# Vivado block design rfdc_ex, xczu48dr-fsvg1517-2-e, Vivado 2021.2
# (continued, part 2 of 4)
current_bd_instance /clocking_block

# ---- hierarchy /PS_Subsystem ----
current_bd_instance /PS_Subsystem
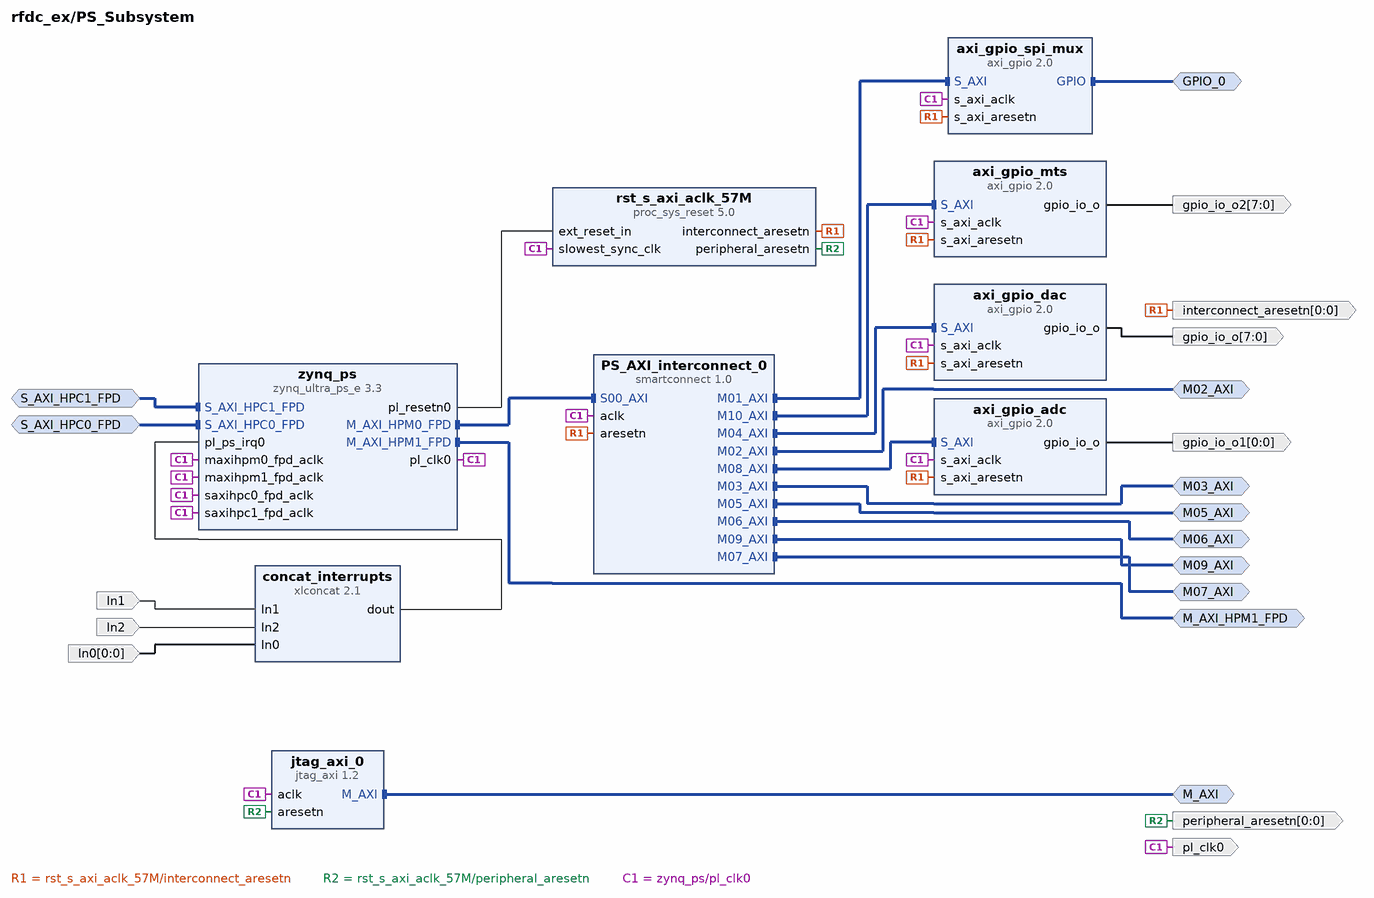
[diagram p4: block diagram inside /PS_Subsystem]
create_bd_intf_pin -mode Master -vlnv xilinx.com:interface:aximm_rtl:1.0 M_AXI
create_bd_intf_pin -mode Master -vlnv xilinx.com:interface:aximm_rtl:1.0 M_AXI_HPM1_FPD
create_bd_intf_pin -mode Master -vlnv xilinx.com:interface:gpio_rtl:1.0 GPIO_0
create_bd_intf_pin -mode Slave -vlnv xilinx.com:interface:aximm_rtl:1.0 S_AXI_HPC1_FPD
create_bd_intf_pin -mode Master -vlnv xilinx.com:interface:aximm_rtl:1.0 M02_AXI
create_bd_intf_pin -mode Master -vlnv xilinx.com:interface:aximm_rtl:1.0 M03_AXI
create_bd_intf_pin -mode Master -vlnv xilinx.com:interface:aximm_rtl:1.0 M05_AXI
create_bd_intf_pin -mode Master -vlnv xilinx.com:interface:aximm_rtl:1.0 M06_AXI
create_bd_intf_pin -mode Master -vlnv xilinx.com:interface:aximm_rtl:1.0 M07_AXI
create_bd_intf_pin -mode Master -vlnv xilinx.com:interface:aximm_rtl:1.0 M09_AXI
create_bd_intf_pin -mode Slave -vlnv xilinx.com:interface:aximm_rtl:1.0 S_AXI_HPC0_FPD
create_bd_pin -dir I -from 0 -to 0 In0
create_bd_pin -dir O -type clk pl_clk0
create_bd_pin -dir O -from 0 -to 0 -type rst peripheral_aresetn
create_bd_pin -dir O -from 0 -to 0 -type rst interconnect_aresetn
create_bd_pin -dir O -from 7 -to 0 gpio_io_o
create_bd_pin -dir I -type intr In1
create_bd_pin -dir O -from 0 -to 0 gpio_io_o1
create_bd_pin -dir I -type intr In2
create_bd_pin -dir O -from 7 -to 0 gpio_io_o2

create_bd_cell -type ip -vlnv xilinx.com:ip:xlconcat:2.1 concat_interrupts
set_property -dict {CONFIG.NUM_PORTS 3} [get_bd_cells concat_interrupts]
create_bd_cell -type ip -vlnv xilinx.com:ip:jtag_axi:1.2 jtag_axi_0
create_bd_cell -type ip -vlnv xilinx.com:ip:zynq_ultra_ps_e:3.3 zynq_ps
set_property -dict [list \
  CONFIG.PSU_BANK_0_IO_STANDARD LVCMOS18 \
  CONFIG.PSU_BANK_1_IO_STANDARD LVCMOS18 \
  CONFIG.PSU_BANK_2_IO_STANDARD LVCMOS18 \
  CONFIG.PSU_USB3__DUAL_CLOCK_ENABLE 1 \
  CONFIG.PSU__CAN1__PERIPHERAL__ENABLE 0 \
  CONFIG.PSU__CRF_APB__ACPU_CTRL__FREQMHZ 1200 \
  CONFIG.PSU__CRF_APB__ACPU_CTRL__SRCSEL APLL \
  CONFIG.PSU__CRF_APB__APLL_CTRL__SRCSEL PSS_REF_CLK \
  CONFIG.PSU__CRF_APB__DBG_FPD_CTRL__FREQMHZ 250 \
  CONFIG.PSU__CRF_APB__DBG_FPD_CTRL__SRCSEL IOPLL \
  CONFIG.PSU__CRF_APB__DBG_TRACE_CTRL__FREQMHZ 250 \
  CONFIG.PSU__CRF_APB__DBG_TRACE_CTRL__SRCSEL IOPLL \
  CONFIG.PSU__CRF_APB__DBG_TSTMP_CTRL__FREQMHZ 250 \
  CONFIG.PSU__CRF_APB__DBG_TSTMP_CTRL__SRCSEL IOPLL \
  CONFIG.PSU__CRF_APB__DDR_CTRL__FREQMHZ 1066 \
  CONFIG.PSU__CRF_APB__DDR_CTRL__SRCSEL DPLL \
  CONFIG.PSU__CRF_APB__DPDMA_REF_CTRL__FREQMHZ 600 \
  CONFIG.PSU__CRF_APB__DPDMA_REF_CTRL__SRCSEL APLL \
  CONFIG.PSU__CRF_APB__DPLL_CTRL__SRCSEL PSS_REF_CLK \
  CONFIG.PSU__CRF_APB__DP_AUDIO_REF_CTRL__SRCSEL RPLL \
  CONFIG.PSU__CRF_APB__DP_STC_REF_CTRL__SRCSEL RPLL \
  CONFIG.PSU__CRF_APB__DP_VIDEO_REF_CTRL__SRCSEL VPLL \
  CONFIG.PSU__CRF_APB__GDMA_REF_CTRL__FREQMHZ 600 \
  CONFIG.PSU__CRF_APB__GDMA_REF_CTRL__SRCSEL APLL \
  CONFIG.PSU__CRF_APB__GPU_REF_CTRL__FREQMHZ 500 \
  CONFIG.PSU__CRF_APB__GPU_REF_CTRL__SRCSEL IOPLL \
  CONFIG.PSU__CRF_APB__TOPSW_LSBUS_CTRL__FREQMHZ 100 \
  CONFIG.PSU__CRF_APB__TOPSW_LSBUS_CTRL__SRCSEL IOPLL \
  CONFIG.PSU__CRF_APB__TOPSW_MAIN_CTRL__FREQMHZ 533.33 \
  CONFIG.PSU__CRF_APB__TOPSW_MAIN_CTRL__SRCSEL DPLL \
  CONFIG.PSU__CRF_APB__VPLL_CTRL__SRCSEL PSS_REF_CLK \
  CONFIG.PSU__CRL_APB__ADMA_REF_CTRL__FREQMHZ 500 \
  CONFIG.PSU__CRL_APB__ADMA_REF_CTRL__SRCSEL IOPLL \
  CONFIG.PSU__CRL_APB__CAN1_REF_CTRL__FREQMHZ 100 \
  CONFIG.PSU__CRL_APB__CAN1_REF_CTRL__SRCSEL IOPLL \
  CONFIG.PSU__CRL_APB__CPU_R5_CTRL__FREQMHZ 500 \
  CONFIG.PSU__CRL_APB__CPU_R5_CTRL__SRCSEL IOPLL \
  CONFIG.PSU__CRL_APB__DBG_LPD_CTRL__FREQMHZ 250 \
  CONFIG.PSU__CRL_APB__DBG_LPD_CTRL__SRCSEL IOPLL \
  CONFIG.PSU__CRL_APB__GEM3_REF_CTRL__FREQMHZ 125 \
  CONFIG.PSU__CRL_APB__GEM3_REF_CTRL__SRCSEL IOPLL \
  CONFIG.PSU__CRL_APB__I2C0_REF_CTRL__FREQMHZ 100 \
  CONFIG.PSU__CRL_APB__I2C0_REF_CTRL__SRCSEL IOPLL \
  CONFIG.PSU__CRL_APB__I2C1_REF_CTRL__FREQMHZ 100 \
  CONFIG.PSU__CRL_APB__I2C1_REF_CTRL__SRCSEL IOPLL \
  CONFIG.PSU__CRL_APB__IOPLL_CTRL__SRCSEL PSS_REF_CLK \
  CONFIG.PSU__CRL_APB__IOU_SWITCH_CTRL__FREQMHZ 250 \
  CONFIG.PSU__CRL_APB__IOU_SWITCH_CTRL__SRCSEL IOPLL \
  CONFIG.PSU__CRL_APB__LPD_LSBUS_CTRL__FREQMHZ 100 \
  CONFIG.PSU__CRL_APB__LPD_LSBUS_CTRL__SRCSEL IOPLL \
  CONFIG.PSU__CRL_APB__LPD_SWITCH_CTRL__FREQMHZ 500 \
  CONFIG.PSU__CRL_APB__LPD_SWITCH_CTRL__SRCSEL IOPLL \
  CONFIG.PSU__CRL_APB__PCAP_CTRL__FREQMHZ 200 \
  CONFIG.PSU__CRL_APB__PCAP_CTRL__SRCSEL IOPLL \
  CONFIG.PSU__CRL_APB__PL0_REF_CTRL__FREQMHZ 100 \
  CONFIG.PSU__CRL_APB__PL0_REF_CTRL__SRCSEL IOPLL \
  CONFIG.PSU__CRL_APB__QSPI_REF_CTRL__FREQMHZ 125 \
  CONFIG.PSU__CRL_APB__QSPI_REF_CTRL__SRCSEL IOPLL \
  CONFIG.PSU__CRL_APB__RPLL_CTRL__SRCSEL PSS_REF_CLK \
  CONFIG.PSU__CRL_APB__SDIO1_REF_CTRL__FREQMHZ 200 \
  CONFIG.PSU__CRL_APB__SDIO1_REF_CTRL__SRCSEL IOPLL \
  CONFIG.PSU__CRL_APB__TIMESTAMP_REF_CTRL__FREQMHZ 100 \
  CONFIG.PSU__CRL_APB__TIMESTAMP_REF_CTRL__SRCSEL IOPLL \
  CONFIG.PSU__CRL_APB__UART0_REF_CTRL__FREQMHZ 100 \
  CONFIG.PSU__CRL_APB__UART0_REF_CTRL__SRCSEL IOPLL \
  CONFIG.PSU__CRL_APB__UART1_REF_CTRL__FREQMHZ 100 \
  CONFIG.PSU__CRL_APB__UART1_REF_CTRL__SRCSEL IOPLL \
  CONFIG.PSU__CRL_APB__USB0_BUS_REF_CTRL__FREQMHZ 250 \
  CONFIG.PSU__CRL_APB__USB0_BUS_REF_CTRL__SRCSEL IOPLL \
  CONFIG.PSU__CRL_APB__USB3_DUAL_REF_CTRL__FREQMHZ 20 \
  CONFIG.PSU__CRL_APB__USB3_DUAL_REF_CTRL__SRCSEL IOPLL \
  CONFIG.PSU__CRL_APB__USB3__ENABLE 1 \
  CONFIG.PSU__CSUPMU__PERIPHERAL__VALID 1 \
  CONFIG.PSU__DDRC__BUS_WIDTH {64 Bit} \
  CONFIG.PSU__DDRC__COMPONENTS UDIMM \
  CONFIG.PSU__DDRC__DEVICE_CAPACITY {8192 MBits} \
  CONFIG.PSU__DDRC__DRAM_WIDTH {16 Bits} \
  CONFIG.PSU__DDRC__ECC Disabled \
  CONFIG.PSU__DDRC__MEMORY_TYPE {DDR 4} \
  CONFIG.PSU__DDRC__SPEED_BIN DDR4_2133P \
  CONFIG.PSU__DDR_HIGH_ADDRESS_GUI_ENABLE 1 \
  CONFIG.PSU__DDR__INTERFACE__FREQMHZ 533.000 \
  CONFIG.PSU__DLL__ISUSED 1 \
  CONFIG.PSU__ENET3__FIFO__ENABLE 0 \
  CONFIG.PSU__ENET3__GRP_MDIO__ENABLE 1 \
  CONFIG.PSU__ENET3__GRP_MDIO__IO {MIO 76 .. 77} \
  CONFIG.PSU__ENET3__PERIPHERAL__ENABLE 1 \
  CONFIG.PSU__ENET3__PERIPHERAL__IO {MIO 64 .. 75} \
  CONFIG.PSU__ENET3__PTP__ENABLE 0 \
  CONFIG.PSU__ENET3__TSU__ENABLE 0 \
  CONFIG.PSU__FPGA_PL0_ENABLE 1 \
  CONFIG.PSU__GEM3_COHERENCY 0 \
  CONFIG.PSU__GEM3_ROUTE_THROUGH_FPD 0 \
  CONFIG.PSU__GEM__TSU__ENABLE 0 \
  CONFIG.PSU__GPIO0_MIO__IO {MIO 0 .. 25} \
  CONFIG.PSU__GPIO0_MIO__PERIPHERAL__ENABLE 1 \
  CONFIG.PSU__GPIO1_MIO__IO {MIO 26 .. 51} \
  CONFIG.PSU__GPIO1_MIO__PERIPHERAL__ENABLE 1 \
  CONFIG.PSU__I2C0__PERIPHERAL__ENABLE 1 \
  CONFIG.PSU__I2C0__PERIPHERAL__IO {MIO 14 .. 15} \
  CONFIG.PSU__I2C1__PERIPHERAL__ENABLE 1 \
  CONFIG.PSU__I2C1__PERIPHERAL__IO {MIO 16 .. 17} \
  CONFIG.PSU__IOU_SLCR__IOU_TTC_APB_CLK__TTC0_SEL APB \
  CONFIG.PSU__IOU_SLCR__IOU_TTC_APB_CLK__TTC1_SEL APB \
  CONFIG.PSU__IOU_SLCR__IOU_TTC_APB_CLK__TTC2_SEL APB \
  CONFIG.PSU__IOU_SLCR__IOU_TTC_APB_CLK__TTC3_SEL APB \
  CONFIG.PSU__MAXIGP0__DATA_WIDTH 128 \
  CONFIG.PSU__OVERRIDE__BASIC_CLOCK 0 \
  CONFIG.PSU__PMU_COHERENCY 0 \
  CONFIG.PSU__PMU__AIBACK__ENABLE 0 \
  CONFIG.PSU__PMU__EMIO_GPI__ENABLE 0 \
  CONFIG.PSU__PMU__EMIO_GPO__ENABLE 0 \
  CONFIG.PSU__PMU__GPI0__ENABLE 0 \
  CONFIG.PSU__PMU__GPI1__ENABLE 0 \
  CONFIG.PSU__PMU__GPI2__ENABLE 0 \
  CONFIG.PSU__PMU__GPI3__ENABLE 0 \
  CONFIG.PSU__PMU__GPI4__ENABLE 0 \
  CONFIG.PSU__PMU__GPI5__ENABLE 0 \
  CONFIG.PSU__PMU__GPO0__ENABLE 1 \
  CONFIG.PSU__PMU__GPO0__IO {MIO 32} \
  CONFIG.PSU__PMU__GPO1__ENABLE 1 \
  CONFIG.PSU__PMU__GPO1__IO {MIO 33} \
  CONFIG.PSU__PMU__GPO2__ENABLE 1 \
  CONFIG.PSU__PMU__GPO2__IO {MIO 34} \
  CONFIG.PSU__PMU__GPO2__POLARITY low \
  CONFIG.PSU__PMU__GPO3__ENABLE 1 \
  CONFIG.PSU__PMU__GPO3__IO {MIO 35} \
  CONFIG.PSU__PMU__GPO3__POLARITY low \
  CONFIG.PSU__PMU__GPO4__ENABLE 1 \
  CONFIG.PSU__PMU__GPO4__IO {MIO 36} \
  CONFIG.PSU__PMU__GPO4__POLARITY low \
  CONFIG.PSU__PMU__GPO5__ENABLE 1 \
  CONFIG.PSU__PMU__GPO5__IO {MIO 37} \
  CONFIG.PSU__PMU__GPO5__POLARITY low \
  CONFIG.PSU__PMU__PERIPHERAL__ENABLE 1 \
  CONFIG.PSU__PMU__PLERROR__ENABLE 0 \
  CONFIG.PSU__PRESET_APPLIED 1 \
  CONFIG.PSU__PSS_REF_CLK__FREQMHZ 33.333 \
  CONFIG.PSU__QSPI_COHERENCY 0 \
  CONFIG.PSU__QSPI_ROUTE_THROUGH_FPD 0 \
  CONFIG.PSU__QSPI__GRP_FBCLK__ENABLE 1 \
  CONFIG.PSU__QSPI__GRP_FBCLK__IO {MIO 6} \
  CONFIG.PSU__QSPI__PERIPHERAL__DATA_MODE x4 \
  CONFIG.PSU__QSPI__PERIPHERAL__ENABLE 1 \
  CONFIG.PSU__QSPI__PERIPHERAL__IO {MIO 0 .. 12} \
  CONFIG.PSU__QSPI__PERIPHERAL__MODE {Dual Parallel} \
  CONFIG.PSU__SATA__LANE1__IO {GT Lane3} \
  CONFIG.PSU__SATA__PERIPHERAL__ENABLE 1 \
  CONFIG.PSU__SATA__REF_CLK_FREQ 125 \
  CONFIG.PSU__SATA__REF_CLK_SEL {Ref Clk3} \
  CONFIG.PSU__SAXIGP0__DATA_WIDTH 32 \
  CONFIG.PSU__SAXIGP1__DATA_WIDTH 32 \
  CONFIG.PSU__SD1_COHERENCY 0 \
  CONFIG.PSU__SD1_ROUTE_THROUGH_FPD 0 \
  CONFIG.PSU__SD1__DATA_TRANSFER_MODE 8Bit \
  CONFIG.PSU__SD1__GRP_CD__ENABLE 1 \
  CONFIG.PSU__SD1__GRP_CD__IO {MIO 45} \
  CONFIG.PSU__SD1__GRP_POW__ENABLE 0 \
  CONFIG.PSU__SD1__GRP_WP__ENABLE 0 \
  CONFIG.PSU__SD1__PERIPHERAL__ENABLE 1 \
  CONFIG.PSU__SD1__PERIPHERAL__IO {MIO 39 .. 51} \
  CONFIG.PSU__SD1__SLOT_TYPE {SD 3.0} \
  CONFIG.PSU__SWDT0__CLOCK__ENABLE 0 \
  CONFIG.PSU__SWDT0__PERIPHERAL__ENABLE 1 \
  CONFIG.PSU__SWDT0__RESET__ENABLE 0 \
  CONFIG.PSU__SWDT1__CLOCK__ENABLE 0 \
  CONFIG.PSU__SWDT1__PERIPHERAL__ENABLE 1 \
  CONFIG.PSU__SWDT1__RESET__ENABLE 0 \
  CONFIG.PSU__TSU__BUFG_PORT_PAIR 0 \
  CONFIG.PSU__TTC0__CLOCK__ENABLE 0 \
  CONFIG.PSU__TTC0__PERIPHERAL__ENABLE 1 \
  CONFIG.PSU__TTC0__WAVEOUT__ENABLE 0 \
  CONFIG.PSU__TTC1__CLOCK__ENABLE 0 \
  CONFIG.PSU__TTC1__PERIPHERAL__ENABLE 1 \
  CONFIG.PSU__TTC1__WAVEOUT__ENABLE 0 \
  CONFIG.PSU__TTC2__CLOCK__ENABLE 0 \
  CONFIG.PSU__TTC2__PERIPHERAL__ENABLE 1 \
  CONFIG.PSU__TTC2__WAVEOUT__ENABLE 0 \
  CONFIG.PSU__TTC3__CLOCK__ENABLE 0 \
  CONFIG.PSU__TTC3__PERIPHERAL__ENABLE 1 \
  CONFIG.PSU__TTC3__WAVEOUT__ENABLE 0 \
  CONFIG.PSU__UART0__BAUD_RATE 115200 \
  CONFIG.PSU__UART0__MODEM__ENABLE 0 \
  CONFIG.PSU__UART0__PERIPHERAL__ENABLE 1 \
  CONFIG.PSU__UART0__PERIPHERAL__IO {MIO 18 .. 19} \
  CONFIG.PSU__USB0_COHERENCY 0 \
  CONFIG.PSU__USB0__PERIPHERAL__ENABLE 1 \
  CONFIG.PSU__USB0__PERIPHERAL__IO {MIO 52 .. 63} \
  CONFIG.PSU__USB0__REF_CLK_FREQ 26 \
  CONFIG.PSU__USB0__REF_CLK_SEL {Ref Clk2} \
  CONFIG.PSU__USB2_0__EMIO__ENABLE 0 \
  CONFIG.PSU__USB3_0__EMIO__ENABLE 0 \
  CONFIG.PSU__USB3_0__PERIPHERAL__ENABLE 1 \
  CONFIG.PSU__USB3_0__PERIPHERAL__IO {GT Lane2} \
  CONFIG.PSU__USB__RESET__MODE {Boot Pin} \
  CONFIG.PSU__USB__RESET__POLARITY {Active Low} \
  CONFIG.PSU__USE__IRQ0 1 \
  CONFIG.PSU__USE__M_AXI_GP0 1 \
  CONFIG.PSU__USE__M_AXI_GP1 1 \
  CONFIG.PSU__USE__M_AXI_GP2 0 \
  CONFIG.PSU__USE__S_AXI_GP0 1 \
  CONFIG.PSU__USE__S_AXI_GP1 1 \
] [get_bd_cells zynq_ps]
# 102 more settings of zynq_ps are not shown: defaults, MIO pin electricals, DDR timing, and values the tool derives
create_bd_cell -type ip -vlnv xilinx.com:ip:smartconnect:1.0 PS_AXI_interconnect_0
set_property -dict [list \
  CONFIG.ADVANCED_PROPERTIES { __view__ { functional { SW0 { DATA_WIDTH 256 } } }} \
  CONFIG.HAS_ARESETN 1 \
  CONFIG.NUM_CLKS 1 \
  CONFIG.NUM_MI 11 \
  CONFIG.NUM_SI 1 \
] [get_bd_cells PS_AXI_interconnect_0]
create_bd_cell -type ip -vlnv xilinx.com:ip:proc_sys_reset:5.0 rst_s_axi_aclk_57M
create_bd_cell -type ip -vlnv xilinx.com:ip:axi_gpio:2.0 axi_gpio_spi_mux
set_property -dict {CONFIG.C_ALL_OUTPUTS 1 CONFIG.C_GPIO_WIDTH 2} [get_bd_cells axi_gpio_spi_mux]
create_bd_cell -type ip -vlnv xilinx.com:ip:axi_gpio:2.0 axi_gpio_dac
set_property -dict {CONFIG.C_ALL_OUTPUTS 1 CONFIG.C_GPIO_WIDTH 8} [get_bd_cells axi_gpio_dac]
create_bd_cell -type ip -vlnv xilinx.com:ip:axi_gpio:2.0 axi_gpio_adc
set_property -dict {CONFIG.C_ALL_OUTPUTS 1 CONFIG.C_DOUT_DEFAULT 0x0000000f CONFIG.C_GPIO_WIDTH 1} [get_bd_cells axi_gpio_adc]
create_bd_cell -type ip -vlnv xilinx.com:ip:axi_gpio:2.0 axi_gpio_mts
set_property -dict {CONFIG.C_ALL_OUTPUTS 1 CONFIG.C_DOUT_DEFAULT 0xffffffff CONFIG.C_GPIO_WIDTH 8} [get_bd_cells axi_gpio_mts]

# ---- hierarchy /DAC_DDR_DMA ----
current_bd_instance /DAC_DDR_DMA
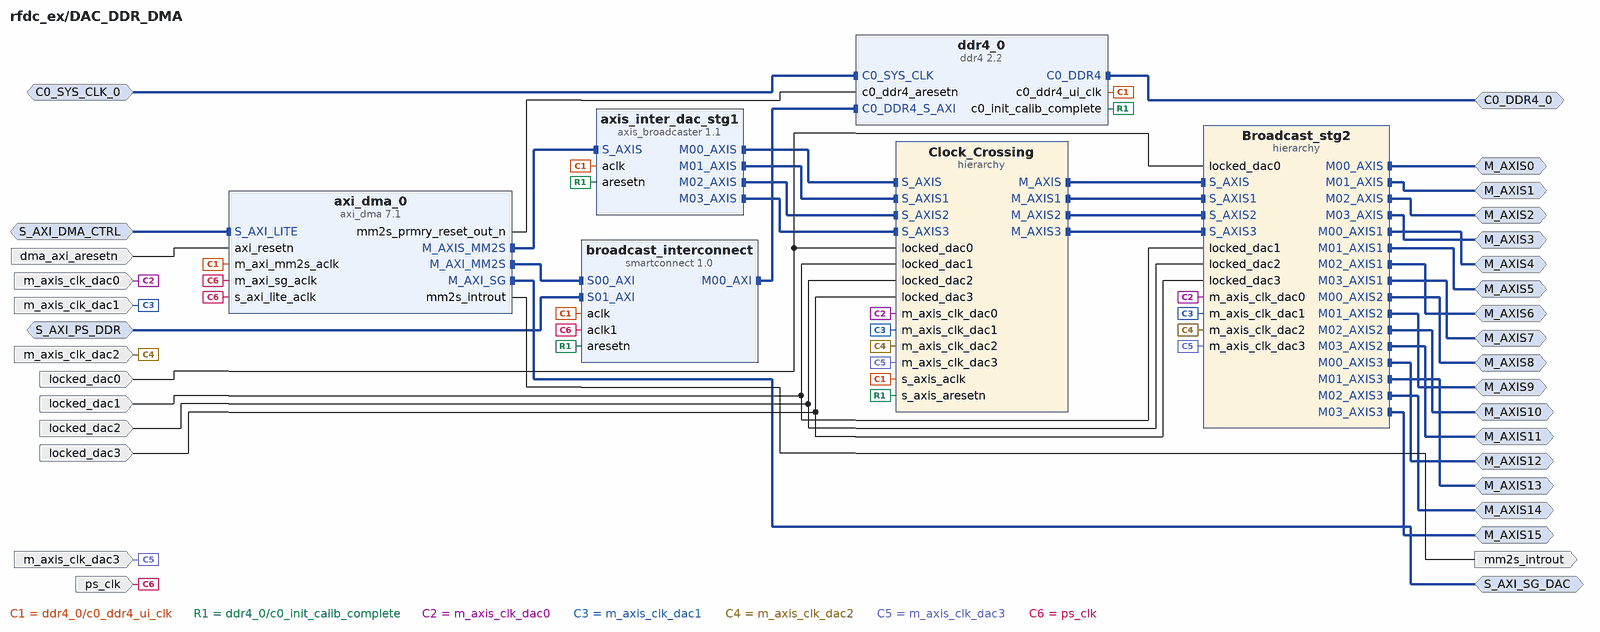
[diagram p5: block diagram inside /DAC_DDR_DMA]
create_bd_intf_pin -mode Master -vlnv xilinx.com:interface:ddr4_rtl:1.0 C0_DDR4_0
create_bd_intf_pin -mode Slave -vlnv xilinx.com:interface:diff_clock_rtl:1.0 C0_SYS_CLK_0
create_bd_intf_pin -mode Master -vlnv xilinx.com:interface:axis_rtl:1.0 M_AXIS0
create_bd_intf_pin -mode Master -vlnv xilinx.com:interface:axis_rtl:1.0 M_AXIS1
create_bd_intf_pin -mode Master -vlnv xilinx.com:interface:axis_rtl:1.0 M_AXIS2
create_bd_intf_pin -mode Master -vlnv xilinx.com:interface:axis_rtl:1.0 M_AXIS3
create_bd_intf_pin -mode Master -vlnv xilinx.com:interface:axis_rtl:1.0 M_AXIS4
create_bd_intf_pin -mode Master -vlnv xilinx.com:interface:axis_rtl:1.0 M_AXIS5
create_bd_intf_pin -mode Master -vlnv xilinx.com:interface:axis_rtl:1.0 M_AXIS6
create_bd_intf_pin -mode Master -vlnv xilinx.com:interface:axis_rtl:1.0 M_AXIS7
create_bd_intf_pin -mode Master -vlnv xilinx.com:interface:axis_rtl:1.0 M_AXIS8
create_bd_intf_pin -mode Master -vlnv xilinx.com:interface:axis_rtl:1.0 M_AXIS9
create_bd_intf_pin -mode Master -vlnv xilinx.com:interface:axis_rtl:1.0 M_AXIS10
create_bd_intf_pin -mode Master -vlnv xilinx.com:interface:axis_rtl:1.0 M_AXIS11
create_bd_intf_pin -mode Master -vlnv xilinx.com:interface:axis_rtl:1.0 M_AXIS12
create_bd_intf_pin -mode Master -vlnv xilinx.com:interface:axis_rtl:1.0 M_AXIS13
create_bd_intf_pin -mode Master -vlnv xilinx.com:interface:axis_rtl:1.0 M_AXIS14
create_bd_intf_pin -mode Master -vlnv xilinx.com:interface:axis_rtl:1.0 M_AXIS15
create_bd_intf_pin -mode Slave -vlnv xilinx.com:interface:aximm_rtl:1.0 S_AXI_DMA_CTRL
create_bd_intf_pin -mode Slave -vlnv xilinx.com:interface:aximm_rtl:1.0 S_AXI_PS_DDR
create_bd_intf_pin -mode Master -vlnv xilinx.com:interface:aximm_rtl:1.0 S_AXI_SG_DAC
create_bd_pin -dir I -type clk m_axis_clk_dac0
create_bd_pin -dir I -type rst locked_dac0
create_bd_pin -dir I -type clk m_axis_clk_dac1
create_bd_pin -dir I -type rst locked_dac1
create_bd_pin -dir I -type clk m_axis_clk_dac2
create_bd_pin -dir I -type rst locked_dac2
create_bd_pin -dir I -type clk m_axis_clk_dac3
create_bd_pin -dir I -type rst locked_dac3
create_bd_pin -dir I -type rst dma_axi_aresetn
create_bd_pin -dir I -type clk ps_clk
create_bd_pin -dir O -type intr mm2s_introut

create_bd_cell -type ip -vlnv xilinx.com:ip:axi_dma:7.1 axi_dma_0
set_property -dict [list \
  CONFIG.c_addr_width 64 \
  CONFIG.c_include_mm2s_dre 1 \
  CONFIG.c_include_s2mm 0 \
  CONFIG.c_m_axi_mm2s_data_width 256 \
  CONFIG.c_m_axis_mm2s_tdata_width 256 \
  CONFIG.c_mm2s_burst_size 64 \
  CONFIG.c_sg_include_stscntrl_strm 0 \
  CONFIG.c_sg_length_width 26 \
] [get_bd_cells axi_dma_0]
create_bd_cell -type ip -vlnv xilinx.com:ip:axis_broadcaster:1.1 axis_inter_dac_stg1
set_property -dict {CONFIG.NUM_MI 4} [get_bd_cells axis_inter_dac_stg1]
create_bd_cell -type ip -vlnv xilinx.com:ip:ddr4:2.2 ddr4_0
set_property -dict [list \
  CONFIG.C0.BANK_GROUP_WIDTH 2 \
  CONFIG.C0.CS_WIDTH 2 \
  CONFIG.C0.DDR4_AxiAddressWidth 32 \
  CONFIG.C0.DDR4_AxiDataWidth 256 \
  CONFIG.C0.DDR4_CasLatency 19 \
  CONFIG.C0.DDR4_Clamshell true \
  CONFIG.C0.DDR4_DataWidth 32 \
  CONFIG.C0.DDR4_InputClockPeriod 3334 \
  CONFIG.C0.DDR4_MemoryPart MT40A1G8SA-075 \
] [get_bd_cells ddr4_0]
create_bd_cell -type ip -vlnv xilinx.com:ip:smartconnect:1.0 broadcast_interconnect
set_property -dict [list \
  CONFIG.ADVANCED_PROPERTIES { __view__ { functional { SW0 { DATA_WIDTH 256 } } }} \
  CONFIG.NUM_CLKS 2 \
  CONFIG.NUM_MI 1 \
  CONFIG.NUM_SI 2 \
] [get_bd_cells broadcast_interconnect]
create_bd_cell -type hier Clock_Crossing
create_bd_cell -type hier Broadcast_stg2

# ---- hierarchy /DAC_DDR_DMA/Clock_Crossing ----
current_bd_instance /DAC_DDR_DMA/Clock_Crossing
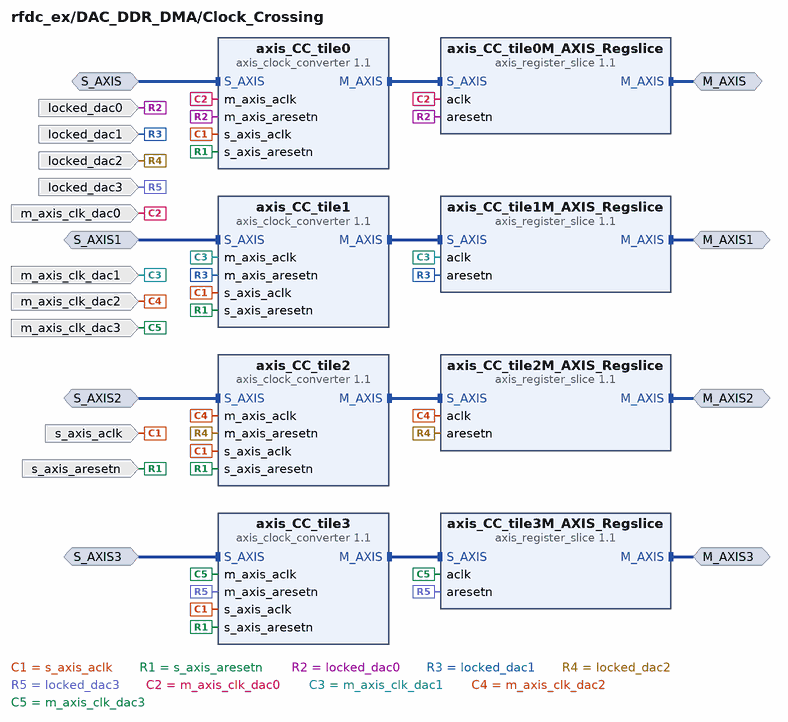
[diagram p6: block diagram inside /DAC_DDR_DMA/Clock_Crossing]
create_bd_intf_pin -mode Slave -vlnv xilinx.com:interface:axis_rtl:1.0 S_AXIS
create_bd_intf_pin -mode Master -vlnv xilinx.com:interface:axis_rtl:1.0 M_AXIS
create_bd_intf_pin -mode Slave -vlnv xilinx.com:interface:axis_rtl:1.0 S_AXIS1
create_bd_intf_pin -mode Master -vlnv xilinx.com:interface:axis_rtl:1.0 M_AXIS1
create_bd_intf_pin -mode Slave -vlnv xilinx.com:interface:axis_rtl:1.0 S_AXIS2
create_bd_intf_pin -mode Master -vlnv xilinx.com:interface:axis_rtl:1.0 M_AXIS2
create_bd_intf_pin -mode Slave -vlnv xilinx.com:interface:axis_rtl:1.0 S_AXIS3
create_bd_intf_pin -mode Master -vlnv xilinx.com:interface:axis_rtl:1.0 M_AXIS3
create_bd_pin -dir I -type rst s_axis_aresetn
create_bd_pin -dir I -type rst locked_dac0
create_bd_pin -dir I -type clk s_axis_aclk
create_bd_pin -dir I -type clk m_axis_clk_dac0
create_bd_pin -dir I -type rst locked_dac1
create_bd_pin -dir I -type clk m_axis_clk_dac1
create_bd_pin -dir I -type rst locked_dac2
create_bd_pin -dir I -type clk m_axis_clk_dac2
create_bd_pin -dir I -type rst locked_dac3
create_bd_pin -dir I -type clk m_axis_clk_dac3

create_bd_cell -type ip -vlnv xilinx.com:ip:axis_clock_converter:1.1 axis_CC_tile0
create_bd_cell -type ip -vlnv xilinx.com:ip:axis_clock_converter:1.1 axis_CC_tile1
create_bd_cell -type ip -vlnv xilinx.com:ip:axis_clock_converter:1.1 axis_CC_tile2
create_bd_cell -type ip -vlnv xilinx.com:ip:axis_clock_converter:1.1 axis_CC_tile3
create_bd_cell -type ip -vlnv xilinx.com:ip:axis_register_slice:1.1 axis_CC_tile0M_AXIS_Regslice
set_property -dict {CONFIG.HAS_TREADY 0} [get_bd_cells axis_CC_tile0M_AXIS_Regslice]
create_bd_cell -type ip -vlnv xilinx.com:ip:axis_register_slice:1.1 axis_CC_tile1M_AXIS_Regslice
set_property -dict {CONFIG.HAS_TREADY 0} [get_bd_cells axis_CC_tile1M_AXIS_Regslice]
create_bd_cell -type ip -vlnv xilinx.com:ip:axis_register_slice:1.1 axis_CC_tile2M_AXIS_Regslice
set_property -dict {CONFIG.HAS_TREADY 0} [get_bd_cells axis_CC_tile2M_AXIS_Regslice]
create_bd_cell -type ip -vlnv xilinx.com:ip:axis_register_slice:1.1 axis_CC_tile3M_AXIS_Regslice
set_property -dict {CONFIG.HAS_TREADY 0} [get_bd_cells axis_CC_tile3M_AXIS_Regslice]

# ---- hierarchy /DAC_DDR_DMA/Broadcast_stg2 ----
current_bd_instance /DAC_DDR_DMA/Broadcast_stg2
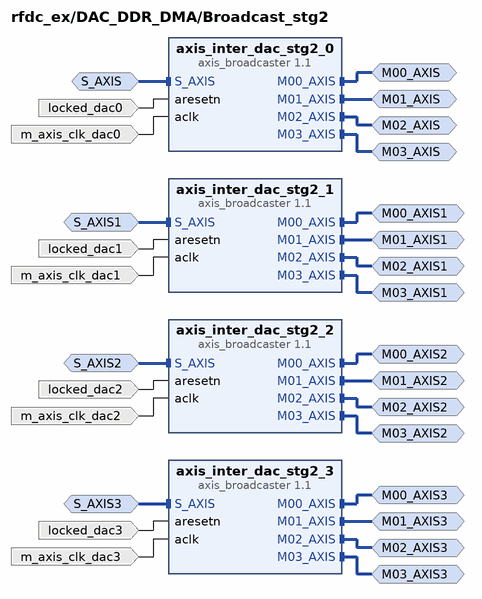
[diagram p7: block diagram inside /DAC_DDR_DMA/Broadcast_stg2]
create_bd_intf_pin -mode Slave -vlnv xilinx.com:interface:axis_rtl:1.0 S_AXIS
create_bd_intf_pin -mode Master -vlnv xilinx.com:interface:axis_rtl:1.0 M00_AXIS
create_bd_intf_pin -mode Master -vlnv xilinx.com:interface:axis_rtl:1.0 M01_AXIS
create_bd_intf_pin -mode Master -vlnv xilinx.com:interface:axis_rtl:1.0 M02_AXIS
create_bd_intf_pin -mode Master -vlnv xilinx.com:interface:axis_rtl:1.0 M03_AXIS
create_bd_intf_pin -mode Slave -vlnv xilinx.com:interface:axis_rtl:1.0 S_AXIS1
create_bd_intf_pin -mode Master -vlnv xilinx.com:interface:axis_rtl:1.0 M00_AXIS1
create_bd_intf_pin -mode Master -vlnv xilinx.com:interface:axis_rtl:1.0 M01_AXIS1
create_bd_intf_pin -mode Master -vlnv xilinx.com:interface:axis_rtl:1.0 M02_AXIS1
create_bd_intf_pin -mode Master -vlnv xilinx.com:interface:axis_rtl:1.0 M03_AXIS1
create_bd_intf_pin -mode Slave -vlnv xilinx.com:interface:axis_rtl:1.0 S_AXIS2
create_bd_intf_pin -mode Master -vlnv xilinx.com:interface:axis_rtl:1.0 M00_AXIS2
create_bd_intf_pin -mode Master -vlnv xilinx.com:interface:axis_rtl:1.0 M01_AXIS2
create_bd_intf_pin -mode Master -vlnv xilinx.com:interface:axis_rtl:1.0 M02_AXIS2
create_bd_intf_pin -mode Master -vlnv xilinx.com:interface:axis_rtl:1.0 M03_AXIS2
create_bd_intf_pin -mode Slave -vlnv xilinx.com:interface:axis_rtl:1.0 S_AXIS3
create_bd_intf_pin -mode Master -vlnv xilinx.com:interface:axis_rtl:1.0 M00_AXIS3
create_bd_intf_pin -mode Master -vlnv xilinx.com:interface:axis_rtl:1.0 M01_AXIS3
create_bd_intf_pin -mode Master -vlnv xilinx.com:interface:axis_rtl:1.0 M02_AXIS3
create_bd_intf_pin -mode Master -vlnv xilinx.com:interface:axis_rtl:1.0 M03_AXIS3
create_bd_pin -dir I -type clk m_axis_clk_dac0
create_bd_pin -dir I -type rst locked_dac0
create_bd_pin -dir I -type clk m_axis_clk_dac1
create_bd_pin -dir I -type rst locked_dac1
create_bd_pin -dir I -type clk m_axis_clk_dac2
create_bd_pin -dir I -type rst locked_dac2
create_bd_pin -dir I -type clk m_axis_clk_dac3
create_bd_pin -dir I -type rst locked_dac3

create_bd_cell -type ip -vlnv xilinx.com:ip:axis_broadcaster:1.1 axis_inter_dac_stg2_0
set_property -dict {CONFIG.NUM_MI 4} [get_bd_cells axis_inter_dac_stg2_0]
create_bd_cell -type ip -vlnv xilinx.com:ip:axis_broadcaster:1.1 axis_inter_dac_stg2_1
set_property -dict {CONFIG.NUM_MI 4} [get_bd_cells axis_inter_dac_stg2_1]
create_bd_cell -type ip -vlnv xilinx.com:ip:axis_broadcaster:1.1 axis_inter_dac_stg2_2
set_property -dict {CONFIG.NUM_MI 4} [get_bd_cells axis_inter_dac_stg2_2]
create_bd_cell -type ip -vlnv xilinx.com:ip:axis_broadcaster:1.1 axis_inter_dac_stg2_3
set_property -dict {CONFIG.NUM_MI 4} [get_bd_cells axis_inter_dac_stg2_3]

# ---- hierarchy /ADC_DDR_DMA ----
current_bd_instance /ADC_DDR_DMA
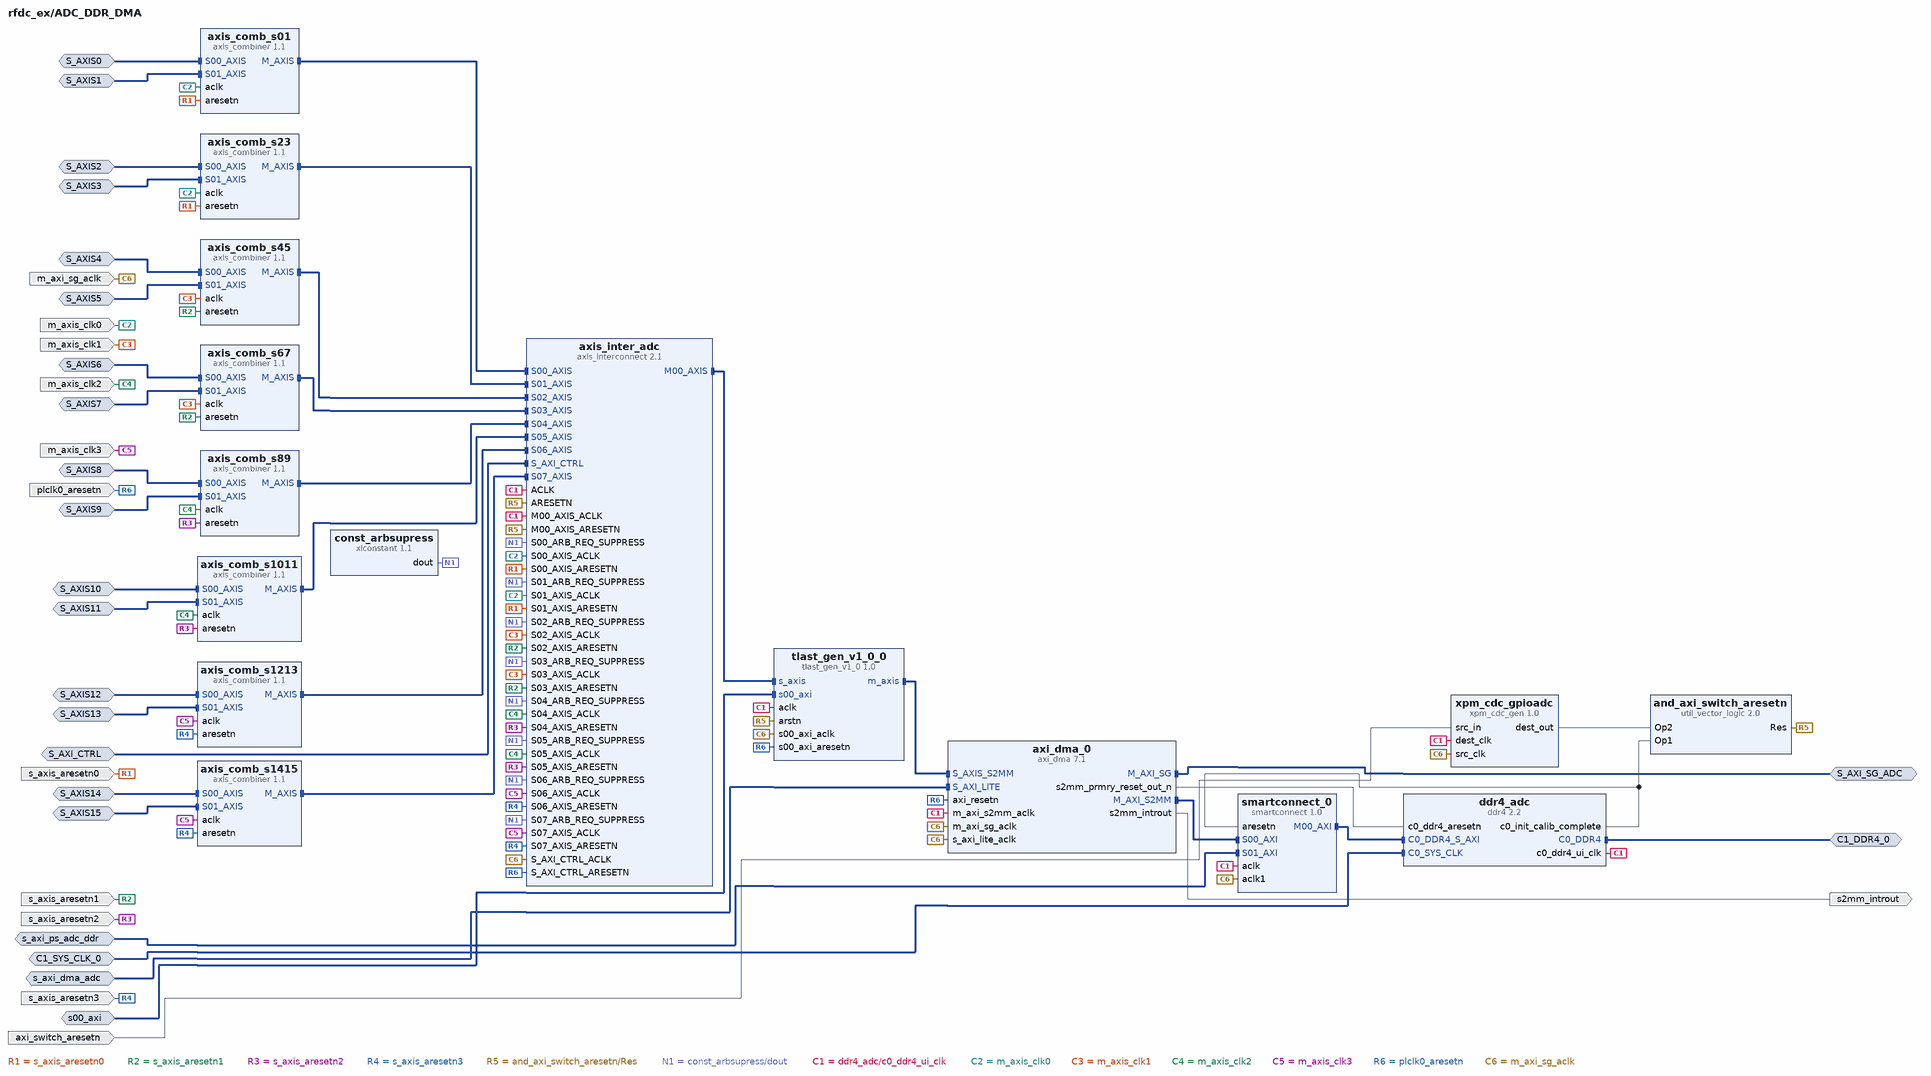
[diagram p8: block diagram inside /ADC_DDR_DMA]
create_bd_intf_pin -mode Slave -vlnv xilinx.com:interface:axis_rtl:1.0 S_AXIS0
create_bd_intf_pin -mode Slave -vlnv xilinx.com:interface:axis_rtl:1.0 S_AXIS1
create_bd_intf_pin -mode Slave -vlnv xilinx.com:interface:axis_rtl:1.0 S_AXIS2
create_bd_intf_pin -mode Slave -vlnv xilinx.com:interface:axis_rtl:1.0 S_AXIS3
create_bd_intf_pin -mode Slave -vlnv xilinx.com:interface:axis_rtl:1.0 S_AXIS4
create_bd_intf_pin -mode Slave -vlnv xilinx.com:interface:axis_rtl:1.0 S_AXIS5
create_bd_intf_pin -mode Slave -vlnv xilinx.com:interface:axis_rtl:1.0 S_AXIS6
create_bd_intf_pin -mode Slave -vlnv xilinx.com:interface:axis_rtl:1.0 S_AXIS7
create_bd_intf_pin -mode Slave -vlnv xilinx.com:interface:axis_rtl:1.0 S_AXIS8
create_bd_intf_pin -mode Slave -vlnv xilinx.com:interface:axis_rtl:1.0 S_AXIS9
create_bd_intf_pin -mode Slave -vlnv xilinx.com:interface:axis_rtl:1.0 S_AXIS10
create_bd_intf_pin -mode Slave -vlnv xilinx.com:interface:axis_rtl:1.0 S_AXIS11
create_bd_intf_pin -mode Slave -vlnv xilinx.com:interface:axis_rtl:1.0 S_AXIS12
create_bd_intf_pin -mode Slave -vlnv xilinx.com:interface:axis_rtl:1.0 S_AXIS13
create_bd_intf_pin -mode Slave -vlnv xilinx.com:interface:axis_rtl:1.0 S_AXIS14
create_bd_intf_pin -mode Slave -vlnv xilinx.com:interface:axis_rtl:1.0 S_AXIS15
create_bd_intf_pin -mode Slave -vlnv xilinx.com:interface:aximm_rtl:1.0 s_axi_dma_adc
create_bd_intf_pin -mode Slave -vlnv xilinx.com:interface:diff_clock_rtl:1.0 C1_SYS_CLK_0
create_bd_intf_pin -mode Master -vlnv xilinx.com:interface:ddr4_rtl:1.0 C1_DDR4_0
create_bd_intf_pin -mode Slave -vlnv xilinx.com:interface:aximm_rtl:1.0 s_axi_ps_adc_ddr
create_bd_intf_pin -mode Master -vlnv xilinx.com:interface:aximm_rtl:1.0 S_AXI_SG_ADC
create_bd_intf_pin -mode Slave -vlnv xilinx.com:interface:aximm_rtl:1.0 S_AXI_CTRL
create_bd_intf_pin -mode Slave -vlnv xilinx.com:interface:aximm_rtl:1.0 s00_axi
create_bd_pin -dir I -type clk m_axi_sg_aclk
create_bd_pin -dir I -type clk m_axis_clk0
create_bd_pin -dir I -type clk m_axis_clk1
create_bd_pin -dir I -type clk m_axis_clk2
create_bd_pin -dir I -type clk m_axis_clk3
create_bd_pin -dir I -type rst plclk0_aresetn
create_bd_pin -dir I -type rst s_axis_aresetn0
create_bd_pin -dir I -type rst s_axis_aresetn1
create_bd_pin -dir I -type rst s_axis_aresetn2
create_bd_pin -dir I -type rst s_axis_aresetn3
create_bd_pin -dir I -type rst axi_switch_aresetn
create_bd_pin -dir O -type intr s2mm_introut

create_bd_cell -type ip -vlnv xilinx.com:ip:util_vector_logic:2.0 and_axi_switch_aresetn
set_property -dict {CONFIG.C_SIZE 1} [get_bd_cells and_axi_switch_aresetn]
create_bd_cell -type ip -vlnv xilinx.com:ip:xpm_cdc_gen:1.0 xpm_cdc_gpioadc
set_property -dict {CONFIG.CDC_TYPE xpm_cdc_single CONFIG.WIDTH 1} [get_bd_cells xpm_cdc_gpioadc]
create_bd_cell -type ip -vlnv xilinx.com:ip:ddr4:2.2 ddr4_adc
set_property -dict [list \
  CONFIG.C0.BANK_GROUP_WIDTH 2 \
  CONFIG.C0.CS_WIDTH 2 \
  CONFIG.C0.DDR4_AxiAddressWidth 32 \
  CONFIG.C0.DDR4_AxiDataWidth 256 \
  CONFIG.C0.DDR4_CasLatency 19 \
  CONFIG.C0.DDR4_Clamshell true \
  CONFIG.C0.DDR4_DataWidth 32 \
  CONFIG.C0.DDR4_InputClockPeriod 3334 \
  CONFIG.C0.DDR4_MemoryPart MT40A1G8SA-075 \
] [get_bd_cells ddr4_adc]
create_bd_cell -type ip -vlnv Xilinx.com:user:tlast_gen_v1_0:1.0 tlast_gen_v1_0_0
set_property -dict {CONFIG.C_S_AXIS_TDATA_WIDTH 512 CONFIG.C_S_AXIS_TKEEP_WIDTH 64} [get_bd_cells tlast_gen_v1_0_0]
create_bd_cell -type ip -vlnv xilinx.com:ip:axi_dma:7.1 axi_dma_0
set_property -dict [list \
  CONFIG.c_addr_width 64 \
  CONFIG.c_include_mm2s 0 \
  CONFIG.c_include_s2mm 1 \
  CONFIG.c_m_axi_s2mm_data_width 512 \
  CONFIG.c_s2mm_burst_size 64 \
  CONFIG.c_s_axis_s2mm_tdata_width 512 \
  CONFIG.c_sg_include_stscntrl_strm 0 \
  CONFIG.c_sg_length_width 26 \
] [get_bd_cells axi_dma_0]
create_bd_cell -type ip -vlnv xilinx.com:ip:smartconnect:1.0 smartconnect_0
set_property -dict {CONFIG.NUM_CLKS 2} [get_bd_cells smartconnect_0]
create_bd_cell -type ip -vlnv xilinx.com:ip:axis_interconnect:2.1 axis_inter_adc
set_property -dict [list \
  CONFIG.M00_FIFO_DEPTH 64 \
  CONFIG.M00_HAS_REGSLICE 1 \
  CONFIG.NUM_MI 1 \
  CONFIG.NUM_SI 8 \
  CONFIG.ROUTING_MODE 1 \
  CONFIG.S00_HAS_REGSLICE 1 \
  CONFIG.S01_HAS_REGSLICE 1 \
  CONFIG.S02_HAS_REGSLICE 1 \
  CONFIG.S03_HAS_REGSLICE 1 \
  CONFIG.S04_HAS_REGSLICE 1 \
  CONFIG.S05_HAS_REGSLICE 1 \
  CONFIG.S06_HAS_REGSLICE 1 \
  CONFIG.S07_HAS_REGSLICE 1 \
  CONFIG.S08_HAS_REGSLICE 1 \
  CONFIG.S09_HAS_REGSLICE 1 \
  CONFIG.S10_HAS_REGSLICE 1 \
  CONFIG.S11_HAS_REGSLICE 1 \
  CONFIG.S12_HAS_REGSLICE 1 \
  CONFIG.S13_HAS_REGSLICE 1 \
  CONFIG.S14_HAS_REGSLICE 1 \
  CONFIG.S15_HAS_REGSLICE 1 \
] [get_bd_cells axis_inter_adc]
create_bd_cell -type ip -vlnv xilinx.com:ip:xlconstant:1.1 const_arbsupress
set_property -dict {CONFIG.CONST_VAL 0} [get_bd_cells const_arbsupress]
create_bd_cell -type ip -vlnv xilinx.com:ip:axis_combiner:1.1 axis_comb_s01
create_bd_cell -type ip -vlnv xilinx.com:ip:axis_combiner:1.1 axis_comb_s23
create_bd_cell -type ip -vlnv xilinx.com:ip:axis_combiner:1.1 axis_comb_s45
create_bd_cell -type ip -vlnv xilinx.com:ip:axis_combiner:1.1 axis_comb_s67
create_bd_cell -type ip -vlnv xilinx.com:ip:axis_combiner:1.1 axis_comb_s89
create_bd_cell -type ip -vlnv xilinx.com:ip:axis_combiner:1.1 axis_comb_s1011
create_bd_cell -type ip -vlnv xilinx.com:ip:axis_combiner:1.1 axis_comb_s1213
create_bd_cell -type ip -vlnv xilinx.com:ip:axis_combiner:1.1 axis_comb_s1415

# ---- connections ----

current_bd_instance /ex_design
connect_bd_intf_net [get_bd_intf_pins sysref_in] [get_bd_intf_pins rfip/sysref_in]
connect_bd_intf_net [get_bd_intf_pins adc2_clk] [get_bd_intf_pins rfip/adc2_clk]
connect_bd_intf_net [get_bd_intf_pins dac0_clk] [get_bd_intf_pins rfip/dac0_clk]
connect_bd_intf_net [get_bd_intf_pins vin0_01] [get_bd_intf_pins rfip/vin0_01]
connect_bd_intf_net [get_bd_intf_pins vin0_23] [get_bd_intf_pins rfip/vin0_23]
connect_bd_intf_net [get_bd_intf_pins vin1_01] [get_bd_intf_pins rfip/vin1_01]
connect_bd_intf_net [get_bd_intf_pins vin1_23] [get_bd_intf_pins rfip/vin1_23]
connect_bd_intf_net [get_bd_intf_pins vin2_01] [get_bd_intf_pins rfip/vin2_01]
connect_bd_intf_net [get_bd_intf_pins vin2_23] [get_bd_intf_pins rfip/vin2_23]
connect_bd_intf_net [get_bd_intf_pins vin3_01] [get_bd_intf_pins rfip/vin3_01]
connect_bd_intf_net [get_bd_intf_pins vin3_23] [get_bd_intf_pins rfip/vin3_23]
connect_bd_intf_net [get_bd_intf_pins vout00] [get_bd_intf_pins rfip/vout00]
connect_bd_intf_net [get_bd_intf_pins vout02] [get_bd_intf_pins rfip/vout02]
connect_bd_intf_net [get_bd_intf_pins vout10] [get_bd_intf_pins rfip/vout10]
connect_bd_intf_net [get_bd_intf_pins vout12] [get_bd_intf_pins rfip/vout12]
connect_bd_intf_net [get_bd_intf_pins vout20] [get_bd_intf_pins rfip/vout20]
connect_bd_intf_net [get_bd_intf_pins m00_0] [get_bd_intf_pins adc_sink_i/m00]
connect_bd_intf_net [get_bd_intf_pins m01_0] [get_bd_intf_pins adc_sink_i/m01]
connect_bd_intf_net [get_bd_intf_pins m02_0] [get_bd_intf_pins adc_sink_i/m02]
connect_bd_intf_net [get_bd_intf_pins m03_0] [get_bd_intf_pins adc_sink_i/m03]
connect_bd_intf_net [get_bd_intf_pins m10_0] [get_bd_intf_pins adc_sink_i/m10]
connect_bd_intf_net [get_bd_intf_pins m11_0] [get_bd_intf_pins adc_sink_i/m11]
connect_bd_intf_net [get_bd_intf_pins m12_0] [get_bd_intf_pins adc_sink_i/m12]
connect_bd_intf_net [get_bd_intf_pins m13_0] [get_bd_intf_pins adc_sink_i/m13]
connect_bd_intf_net [get_bd_intf_pins m20_0] [get_bd_intf_pins adc_sink_i/m20]
connect_bd_intf_net [get_bd_intf_pins m21_0] [get_bd_intf_pins adc_sink_i/m21]
connect_bd_intf_net [get_bd_intf_pins m22_0] [get_bd_intf_pins adc_sink_i/m22]
connect_bd_intf_net [get_bd_intf_pins m23_0] [get_bd_intf_pins adc_sink_i/m23]
connect_bd_intf_net [get_bd_intf_pins m30_0] [get_bd_intf_pins adc_sink_i/m30]
connect_bd_intf_net [get_bd_intf_pins m31_0] [get_bd_intf_pins adc_sink_i/m31]
connect_bd_intf_net [get_bd_intf_pins m32_0] [get_bd_intf_pins adc_sink_i/m32]
connect_bd_intf_net [get_bd_intf_pins m33_0] [get_bd_intf_pins adc_sink_i/m33]
connect_bd_intf_net [get_bd_intf_pins s00_0] [get_bd_intf_pins dac_source_i/s00]
connect_bd_intf_net [get_bd_intf_pins s01_0] [get_bd_intf_pins dac_source_i/s01]
connect_bd_intf_net [get_bd_intf_pins s03_0] [get_bd_intf_pins dac_source_i/s03]
connect_bd_intf_net [get_bd_intf_pins s02_0] [get_bd_intf_pins dac_source_i/s02]
connect_bd_intf_net [get_bd_intf_pins s10_0] [get_bd_intf_pins dac_source_i/s10]
connect_bd_intf_net [get_bd_intf_pins s11_0] [get_bd_intf_pins dac_source_i/s11]
connect_bd_intf_net [get_bd_intf_pins s12_0] [get_bd_intf_pins dac_source_i/s12]
connect_bd_intf_net [get_bd_intf_pins s13_0] [get_bd_intf_pins dac_source_i/s13]
connect_bd_intf_net [get_bd_intf_pins s20_0] [get_bd_intf_pins dac_source_i/s20]
connect_bd_intf_net [get_bd_intf_pins s21_0] [get_bd_intf_pins dac_source_i/s21]
connect_bd_intf_net [get_bd_intf_pins s22_0] [get_bd_intf_pins dac_source_i/s22]
connect_bd_intf_net [get_bd_intf_pins s23_0] [get_bd_intf_pins dac_source_i/s23]
connect_bd_intf_net [get_bd_intf_pins s30_0] [get_bd_intf_pins dac_source_i/s30]
connect_bd_intf_net [get_bd_intf_pins s31_0] [get_bd_intf_pins dac_source_i/s31]
connect_bd_intf_net [get_bd_intf_pins s32_0] [get_bd_intf_pins dac_source_i/s32]
connect_bd_intf_net [get_bd_intf_pins vout22] [get_bd_intf_pins rfip/vout22]
connect_bd_intf_net [get_bd_intf_pins vout30] [get_bd_intf_pins rfip/vout30]
connect_bd_intf_net [get_bd_intf_pins vout32] [get_bd_intf_pins rfip/vout32]
connect_bd_intf_net [get_bd_intf_pins M04_AXI] [get_bd_intf_pins smartconnect_0/M04_AXI]
connect_bd_intf_net [get_bd_intf_pins M05_AXI] [get_bd_intf_pins smartconnect_0/M05_AXI]
connect_bd_intf_net [get_bd_intf_pins M06_AXI] [get_bd_intf_pins smartconnect_0/M06_AXI]
connect_bd_intf_net [get_bd_intf_pins M07_AXI] [get_bd_intf_pins smartconnect_0/M07_AXI]
connect_bd_intf_net [get_bd_intf_pins M08_AXI] [get_bd_intf_pins smartconnect_0/M08_AXI]
connect_bd_intf_net [get_bd_intf_pins M09_AXI] [get_bd_intf_pins smartconnect_0/M09_AXI]
connect_bd_intf_net [get_bd_intf_pins M10_AXI] [get_bd_intf_pins smartconnect_0/M10_AXI]
connect_bd_intf_net [get_bd_intf_pins M11_AXI] [get_bd_intf_pins smartconnect_0/M11_AXI]
connect_bd_intf_net [get_bd_intf_pins S00_AXI] [get_bd_intf_pins smartconnect_0/S00_AXI]
connect_bd_intf_net [get_bd_intf_pins S01_AXI] [get_bd_intf_pins smartconnect_0/S01_AXI]
connect_bd_intf_net [get_bd_intf_pins M12_AXI] [get_bd_intf_pins smartconnect_0/M12_AXI]
connect_bd_intf_net [get_bd_intf_pins s33_0] [get_bd_intf_pins dac_source_i/s33]
connect_bd_intf_net [get_bd_intf_pins dac_source_i/m00] [get_bd_intf_pins rfip/s00_axis]
connect_bd_intf_net [get_bd_intf_pins dac_source_i/m01] [get_bd_intf_pins rfip/s01_axis]
connect_bd_intf_net [get_bd_intf_pins dac_source_i/m02] [get_bd_intf_pins rfip/s02_axis]
connect_bd_intf_net [get_bd_intf_pins dac_source_i/m03] [get_bd_intf_pins rfip/s03_axis]
connect_bd_intf_net [get_bd_intf_pins dac_source_i/m10] [get_bd_intf_pins rfip/s10_axis]
connect_bd_intf_net [get_bd_intf_pins dac_source_i/m11] [get_bd_intf_pins rfip/s11_axis]
connect_bd_intf_net [get_bd_intf_pins dac_source_i/m12] [get_bd_intf_pins rfip/s12_axis]
connect_bd_intf_net [get_bd_intf_pins dac_source_i/m13] [get_bd_intf_pins rfip/s13_axis]
connect_bd_intf_net [get_bd_intf_pins dac_source_i/m20] [get_bd_intf_pins rfip/s20_axis]
connect_bd_intf_net [get_bd_intf_pins dac_source_i/m21] [get_bd_intf_pins rfip/s21_axis]
connect_bd_intf_net [get_bd_intf_pins dac_source_i/m22] [get_bd_intf_pins rfip/s22_axis]
connect_bd_intf_net [get_bd_intf_pins dac_source_i/m23] [get_bd_intf_pins rfip/s23_axis]
connect_bd_intf_net [get_bd_intf_pins dac_source_i/m30] [get_bd_intf_pins rfip/s30_axis]
connect_bd_intf_net [get_bd_intf_pins dac_source_i/m31] [get_bd_intf_pins rfip/s31_axis]
connect_bd_intf_net [get_bd_intf_pins dac_source_i/m32] [get_bd_intf_pins rfip/s32_axis]
connect_bd_intf_net [get_bd_intf_pins dac_source_i/m33] [get_bd_intf_pins rfip/s33_axis]
connect_bd_intf_net [get_bd_intf_pins rfip/m00_axis] [get_bd_intf_pins adc_sink_i/s00]
connect_bd_intf_net [get_bd_intf_pins rfip/m01_axis] [get_bd_intf_pins adc_sink_i/s01]
connect_bd_intf_net [get_bd_intf_pins rfip/m02_axis] [get_bd_intf_pins adc_sink_i/s02]
connect_bd_intf_net [get_bd_intf_pins rfip/m03_axis] [get_bd_intf_pins adc_sink_i/s03]
connect_bd_intf_net [get_bd_intf_pins rfip/m10_axis] [get_bd_intf_pins adc_sink_i/s10]
connect_bd_intf_net [get_bd_intf_pins rfip/m11_axis] [get_bd_intf_pins adc_sink_i/s11]
connect_bd_intf_net [get_bd_intf_pins rfip/m12_axis] [get_bd_intf_pins adc_sink_i/s12]
connect_bd_intf_net [get_bd_intf_pins rfip/m13_axis] [get_bd_intf_pins adc_sink_i/s13]
connect_bd_intf_net [get_bd_intf_pins rfip/m20_axis] [get_bd_intf_pins adc_sink_i/s20]
connect_bd_intf_net [get_bd_intf_pins rfip/m21_axis] [get_bd_intf_pins adc_sink_i/s21]
connect_bd_intf_net [get_bd_intf_pins rfip/m22_axis] [get_bd_intf_pins adc_sink_i/s22]
connect_bd_intf_net [get_bd_intf_pins rfip/m23_axis] [get_bd_intf_pins adc_sink_i/s23]
connect_bd_intf_net [get_bd_intf_pins rfip/m30_axis] [get_bd_intf_pins adc_sink_i/s30]
connect_bd_intf_net [get_bd_intf_pins rfip/m31_axis] [get_bd_intf_pins adc_sink_i/s31]
connect_bd_intf_net [get_bd_intf_pins rfip/m32_axis] [get_bd_intf_pins adc_sink_i/s32]
connect_bd_intf_net [get_bd_intf_pins rfip/m33_axis] [get_bd_intf_pins adc_sink_i/s33]
connect_bd_intf_net [get_bd_intf_pins smartconnect_0/M00_AXI] [get_bd_intf_pins rfip/s_axi]
connect_bd_intf_net [get_bd_intf_pins smartconnect_0/M01_AXI] [get_bd_intf_pins dac_source_i/s_axi]
connect_bd_intf_net [get_bd_intf_pins smartconnect_0/M02_AXI] [get_bd_intf_pins adc_sink_i/s_axi]
connect_bd_intf_net [get_bd_intf_pins smartconnect_0/M03_AXI] [get_bd_intf_pins tdd_module_i/s_axi]
connect_bd_net [get_bd_pins GPIO_DAC] [get_bd_pins GPIO_DAC_Slice/GPIO_DAC]
connect_bd_net [get_bd_pins GPIO_DAC_Slice/Dout0] [get_bd_pins dac_source_i/user_select_00]
connect_bd_net [get_bd_pins GPIO_DAC_Slice/Dout1] [get_bd_pins dac_source_i/user_select_01]
connect_bd_net [get_bd_pins GPIO_DAC_Slice/Dout2] [get_bd_pins dac_source_i/user_select_02]
connect_bd_net [get_bd_pins GPIO_DAC_Slice/Dout3] [get_bd_pins dac_source_i/user_select_03]
connect_bd_net [get_bd_pins GPIO_DAC_Slice/Dout4] [get_bd_pins dac_source_i/user_select_10]
connect_bd_net [get_bd_pins GPIO_DAC_Slice/Dout5] [get_bd_pins dac_source_i/user_select_11]
connect_bd_net [get_bd_pins GPIO_DAC_Slice/Dout6] [get_bd_pins dac_source_i/user_select_12]
connect_bd_net [get_bd_pins GPIO_DAC_Slice/Dout7] [get_bd_pins dac_source_i/user_select_13]
connect_bd_net [get_bd_pins GPIO_DAC_Slice/Dout8] [get_bd_pins dac_source_i/user_select_20]
connect_bd_net [get_bd_pins GPIO_DAC_Slice/Dout9] [get_bd_pins dac_source_i/user_select_21]
connect_bd_net [get_bd_pins GPIO_DAC_Slice/Dout10] [get_bd_pins dac_source_i/user_select_22]
connect_bd_net [get_bd_pins GPIO_DAC_Slice/Dout11] [get_bd_pins dac_source_i/user_select_23]
connect_bd_net [get_bd_pins GPIO_DAC_Slice/Dout12] [get_bd_pins dac_source_i/user_select_30]
connect_bd_net [get_bd_pins GPIO_DAC_Slice/Dout13] [get_bd_pins dac_source_i/user_select_31]
connect_bd_net [get_bd_pins GPIO_DAC_Slice/Dout14] [get_bd_pins dac_source_i/user_select_32]
connect_bd_net [get_bd_pins GPIO_DAC_Slice/Dout15] [get_bd_pins dac_source_i/user_select_33]
connect_bd_net [get_bd_pins dac0_hw_trigger] [get_bd_pins dac_source_i/hw_trigger_0]
connect_bd_net [get_bd_pins dac0_hw_trigger_en] [get_bd_pins dac_source_i/hw_trigger_en_0]
connect_bd_net [get_bd_pins dac1_hw_trigger] [get_bd_pins dac_source_i/hw_trigger_1]
connect_bd_net [get_bd_pins dac1_hw_trigger_en] [get_bd_pins dac_source_i/hw_trigger_en_1]
connect_bd_net [get_bd_pins dac2_hw_trigger] [get_bd_pins dac_source_i/hw_trigger_2]
connect_bd_net [get_bd_pins dac2_hw_trigger_en] [get_bd_pins dac_source_i/hw_trigger_en_2]
connect_bd_net [get_bd_pins dac3_hw_trigger] [get_bd_pins dac_source_i/hw_trigger_3]
connect_bd_net [get_bd_pins dac3_hw_trigger_en] [get_bd_pins dac_source_i/hw_trigger_en_3]
connect_bd_net [get_bd_pins m0_axis_aresetn] [get_bd_pins rfip/m0_axis_aresetn]
connect_bd_net -net m0_axis_clock_1 [get_bd_pins s0_axis_aclk] \
  [get_bd_pins dac_source_i/m0_axis_clock] [get_bd_pins tdd_module_i/dac0_clk] [get_bd_pins rfip/s0_axis_aclk] \
  [get_bd_pins dac_source_i/m0_div2_axis_clock] [get_bd_pins GPIO_DAC_Slice/axis_clk0] [get_bd_pins GPIO_DAC_Slice/axis_clk1] \
  [get_bd_pins GPIO_DAC_Slice/axis_clk2] [get_bd_pins GPIO_DAC_Slice/axis_clk3]
connect_bd_net [get_bd_pins m1_axis_aresetn] [get_bd_pins rfip/m1_axis_aresetn]
connect_bd_net -net m1_axis_clock_1 [get_bd_pins s1_axis_aclk] \
  [get_bd_pins dac_source_i/m1_axis_clock] [get_bd_pins tdd_module_i/dac1_clk] [get_bd_pins rfip/s1_axis_aclk] \
  [get_bd_pins dac_source_i/m1_div2_axis_clock] [get_bd_pins GPIO_DAC_Slice/axis_clk4] [get_bd_pins GPIO_DAC_Slice/axis_clk5] \
  [get_bd_pins GPIO_DAC_Slice/axis_clk6] [get_bd_pins GPIO_DAC_Slice/axis_clk7]
connect_bd_net [get_bd_pins m2_axis_aresetn] [get_bd_pins rfip/m2_axis_aresetn]
connect_bd_net -net m2_axis_clock_1 [get_bd_pins s2_axis_aclk] \
  [get_bd_pins dac_source_i/m2_axis_clock] [get_bd_pins tdd_module_i/dac2_clk] [get_bd_pins rfip/s2_axis_aclk] \
  [get_bd_pins dac_source_i/m2_div2_axis_clock] [get_bd_pins GPIO_DAC_Slice/axis_clk8] [get_bd_pins GPIO_DAC_Slice/axis_clk9] \
  [get_bd_pins GPIO_DAC_Slice/axis_clk10] [get_bd_pins GPIO_DAC_Slice/axis_clk11]
connect_bd_net [get_bd_pins m3_axis_aresetn] [get_bd_pins rfip/m3_axis_aresetn]
connect_bd_net -net m3_axis_clock_1 [get_bd_pins s3_axis_aclk] \
  [get_bd_pins dac_source_i/m3_axis_clock] [get_bd_pins tdd_module_i/dac3_clk] [get_bd_pins rfip/s3_axis_aclk] \
  [get_bd_pins dac_source_i/m3_div2_axis_clock] [get_bd_pins GPIO_DAC_Slice/axis_clk12] \
  [get_bd_pins GPIO_DAC_Slice/axis_clk13] [get_bd_pins GPIO_DAC_Slice/axis_clk14] [get_bd_pins GPIO_DAC_Slice/axis_clk15]
connect_bd_net [get_bd_pins rfip/clk_adc0] [get_bd_pins clk_adc0]
connect_bd_net [get_bd_pins rfip/clk_adc1] [get_bd_pins clk_adc1]
connect_bd_net [get_bd_pins rfip/clk_adc2] [get_bd_pins clk_adc2]
connect_bd_net [get_bd_pins rfip/clk_adc3] [get_bd_pins clk_adc3]
connect_bd_net [get_bd_pins rfip/clk_dac0] [get_bd_pins clk_dac0]
connect_bd_net [get_bd_pins rfip/clk_dac1] [get_bd_pins clk_dac1]
connect_bd_net [get_bd_pins rfip/clk_dac2] [get_bd_pins clk_dac2]
connect_bd_net [get_bd_pins rfip/clk_dac3] [get_bd_pins clk_dac3]
connect_bd_net [get_bd_pins rfip/irq] [get_bd_pins irq]
connect_bd_net [get_bd_pins s0_axis_aresetn] [get_bd_pins rfip/s0_axis_aresetn]
connect_bd_net -net s0_axis_clock_1 [get_bd_pins m0_axis_aclk] \
  [get_bd_pins adc_sink_i/s0_axis_clock] [get_bd_pins tdd_module_i/adc0_clk] [get_bd_pins rfip/m0_axis_aclk] \
  [get_bd_pins adc_sink_i/s0_div2_axis_clock]
connect_bd_net [get_bd_pins s1_axis_aresetn] [get_bd_pins rfip/s1_axis_aresetn]
connect_bd_net -net s1_axis_clock_1 [get_bd_pins m1_axis_aclk] \
  [get_bd_pins adc_sink_i/s1_axis_clock] [get_bd_pins tdd_module_i/adc1_clk] [get_bd_pins rfip/m1_axis_aclk] \
  [get_bd_pins adc_sink_i/s1_div2_axis_clock]
connect_bd_net [get_bd_pins s2_axis_aresetn] [get_bd_pins rfip/s2_axis_aresetn]
connect_bd_net -net s2_axis_clock_1 [get_bd_pins m2_axis_aclk] \
  [get_bd_pins adc_sink_i/s2_axis_clock] [get_bd_pins tdd_module_i/adc2_clk] [get_bd_pins rfip/m2_axis_aclk] \
  [get_bd_pins adc_sink_i/s2_div2_axis_clock]
connect_bd_net [get_bd_pins s3_axis_aresetn] [get_bd_pins rfip/s3_axis_aresetn]
connect_bd_net -net s3_axis_clock_1 [get_bd_pins m3_axis_aclk] \
  [get_bd_pins adc_sink_i/s3_axis_clock] [get_bd_pins tdd_module_i/adc3_clk] [get_bd_pins rfip/m3_axis_aclk] \
  [get_bd_pins adc_sink_i/s3_div2_axis_clock]
connect_bd_net [get_bd_pins s_axi_aclk] \
  [get_bd_pins smartconnect_0/aclk] [get_bd_pins adc_sink_i/s_axi_aclk] [get_bd_pins dac_source_i/s_axi_aclk] \
  [get_bd_pins tdd_module_i/s_axi_aclk] [get_bd_pins rfip/s_axi_aclk] [get_bd_pins GPIO_DAC_Slice/s_axi_aclk]
connect_bd_net [get_bd_pins s_axi_aresetn] \
  [get_bd_pins smartconnect_0/aresetn] [get_bd_pins adc_sink_i/s_axi_aresetn] [get_bd_pins dac_source_i/s_axi_aresetn] \
  [get_bd_pins tdd_module_i/s_axi_aresetn] [get_bd_pins rfip/s_axi_aresetn]
connect_bd_net [get_bd_pins tdd_module_i/adc00_tdd_mode] [get_bd_pins rfip/adc00_tdd_mode]
connect_bd_net [get_bd_pins tdd_module_i/adc01_tdd_mode] [get_bd_pins rfip/adc01_tdd_mode]
connect_bd_net [get_bd_pins tdd_module_i/adc02_tdd_mode] [get_bd_pins rfip/adc02_tdd_mode]
connect_bd_net [get_bd_pins tdd_module_i/adc03_tdd_mode] [get_bd_pins rfip/adc03_tdd_mode]
connect_bd_net [get_bd_pins tdd_module_i/adc10_tdd_mode] [get_bd_pins rfip/adc10_tdd_mode]
connect_bd_net [get_bd_pins tdd_module_i/adc11_tdd_mode] [get_bd_pins rfip/adc11_tdd_mode]
connect_bd_net [get_bd_pins tdd_module_i/adc12_tdd_mode] [get_bd_pins rfip/adc12_tdd_mode]
connect_bd_net [get_bd_pins tdd_module_i/adc13_tdd_mode] [get_bd_pins rfip/adc13_tdd_mode]
connect_bd_net [get_bd_pins tdd_module_i/adc20_tdd_mode] [get_bd_pins rfip/adc20_tdd_mode]
connect_bd_net [get_bd_pins tdd_module_i/adc21_tdd_mode] [get_bd_pins rfip/adc21_tdd_mode]
connect_bd_net [get_bd_pins tdd_module_i/adc22_tdd_mode] [get_bd_pins rfip/adc22_tdd_mode]
connect_bd_net [get_bd_pins tdd_module_i/adc23_tdd_mode] [get_bd_pins rfip/adc23_tdd_mode]
connect_bd_net [get_bd_pins tdd_module_i/adc30_tdd_mode] [get_bd_pins rfip/adc30_tdd_mode]
connect_bd_net [get_bd_pins tdd_module_i/adc31_tdd_mode] [get_bd_pins rfip/adc31_tdd_mode]
connect_bd_net [get_bd_pins tdd_module_i/adc32_tdd_mode] [get_bd_pins rfip/adc32_tdd_mode]
connect_bd_net [get_bd_pins tdd_module_i/adc33_tdd_mode] [get_bd_pins rfip/adc33_tdd_mode]
connect_bd_net [get_bd_pins tdd_module_i/dac00_tdd_mode] [get_bd_pins rfip/dac00_tdd_mode]
connect_bd_net [get_bd_pins tdd_module_i/dac01_tdd_mode] [get_bd_pins rfip/dac01_tdd_mode]
connect_bd_net [get_bd_pins tdd_module_i/dac02_tdd_mode] [get_bd_pins rfip/dac02_tdd_mode]
connect_bd_net [get_bd_pins tdd_module_i/dac03_tdd_mode] [get_bd_pins rfip/dac03_tdd_mode]
connect_bd_net [get_bd_pins tdd_module_i/dac10_tdd_mode] [get_bd_pins rfip/dac10_tdd_mode]
connect_bd_net [get_bd_pins tdd_module_i/dac11_tdd_mode] [get_bd_pins rfip/dac11_tdd_mode]
connect_bd_net [get_bd_pins tdd_module_i/dac12_tdd_mode] [get_bd_pins rfip/dac12_tdd_mode]
connect_bd_net [get_bd_pins tdd_module_i/dac13_tdd_mode] [get_bd_pins rfip/dac13_tdd_mode]
connect_bd_net [get_bd_pins tdd_module_i/dac20_tdd_mode] [get_bd_pins rfip/dac20_tdd_mode]
connect_bd_net [get_bd_pins tdd_module_i/dac21_tdd_mode] [get_bd_pins rfip/dac21_tdd_mode]
connect_bd_net [get_bd_pins tdd_module_i/dac22_tdd_mode] [get_bd_pins rfip/dac22_tdd_mode]
connect_bd_net [get_bd_pins tdd_module_i/dac23_tdd_mode] [get_bd_pins rfip/dac23_tdd_mode]
connect_bd_net [get_bd_pins tdd_module_i/dac30_tdd_mode] [get_bd_pins rfip/dac30_tdd_mode]
connect_bd_net [get_bd_pins tdd_module_i/dac31_tdd_mode] [get_bd_pins rfip/dac31_tdd_mode]
connect_bd_net [get_bd_pins tdd_module_i/dac32_tdd_mode] [get_bd_pins rfip/dac32_tdd_mode]
connect_bd_net [get_bd_pins tdd_module_i/dac33_tdd_mode] [get_bd_pins rfip/dac33_tdd_mode]
connect_bd_net [get_bd_pins tdd_module_i/hw_trigger_en_0] [get_bd_pins adc_sink_i/hw_trigger_en_0]
connect_bd_net [get_bd_pins tdd_module_i/hw_trigger_en_1] [get_bd_pins adc_sink_i/hw_trigger_en_1]
connect_bd_net [get_bd_pins tdd_module_i/hw_trigger_en_2] [get_bd_pins adc_sink_i/hw_trigger_en_2]
connect_bd_net [get_bd_pins tdd_module_i/hw_trigger_en_3] [get_bd_pins adc_sink_i/hw_trigger_en_3]
connect_bd_net [get_bd_pins tdd_module_i/trigger_0] [get_bd_pins adc_sink_i/hw_trigger_0]
connect_bd_net [get_bd_pins tdd_module_i/trigger_1] [get_bd_pins adc_sink_i/hw_trigger_1]
connect_bd_net [get_bd_pins tdd_module_i/trigger_2] [get_bd_pins adc_sink_i/hw_trigger_2]
connect_bd_net [get_bd_pins tdd_module_i/trigger_3] [get_bd_pins adc_sink_i/hw_trigger_3]
connect_bd_net -net user_sysref_adc_0_1 [get_bd_pins user_sysref_adc_0] [get_bd_pins rfip/user_sysref_adc]
connect_bd_net -net user_sysref_dac_0_1 [get_bd_pins user_sysref_dac_0] [get_bd_pins rfip/user_sysref_dac]
